# Altium project HATB-A0.PrjPCB
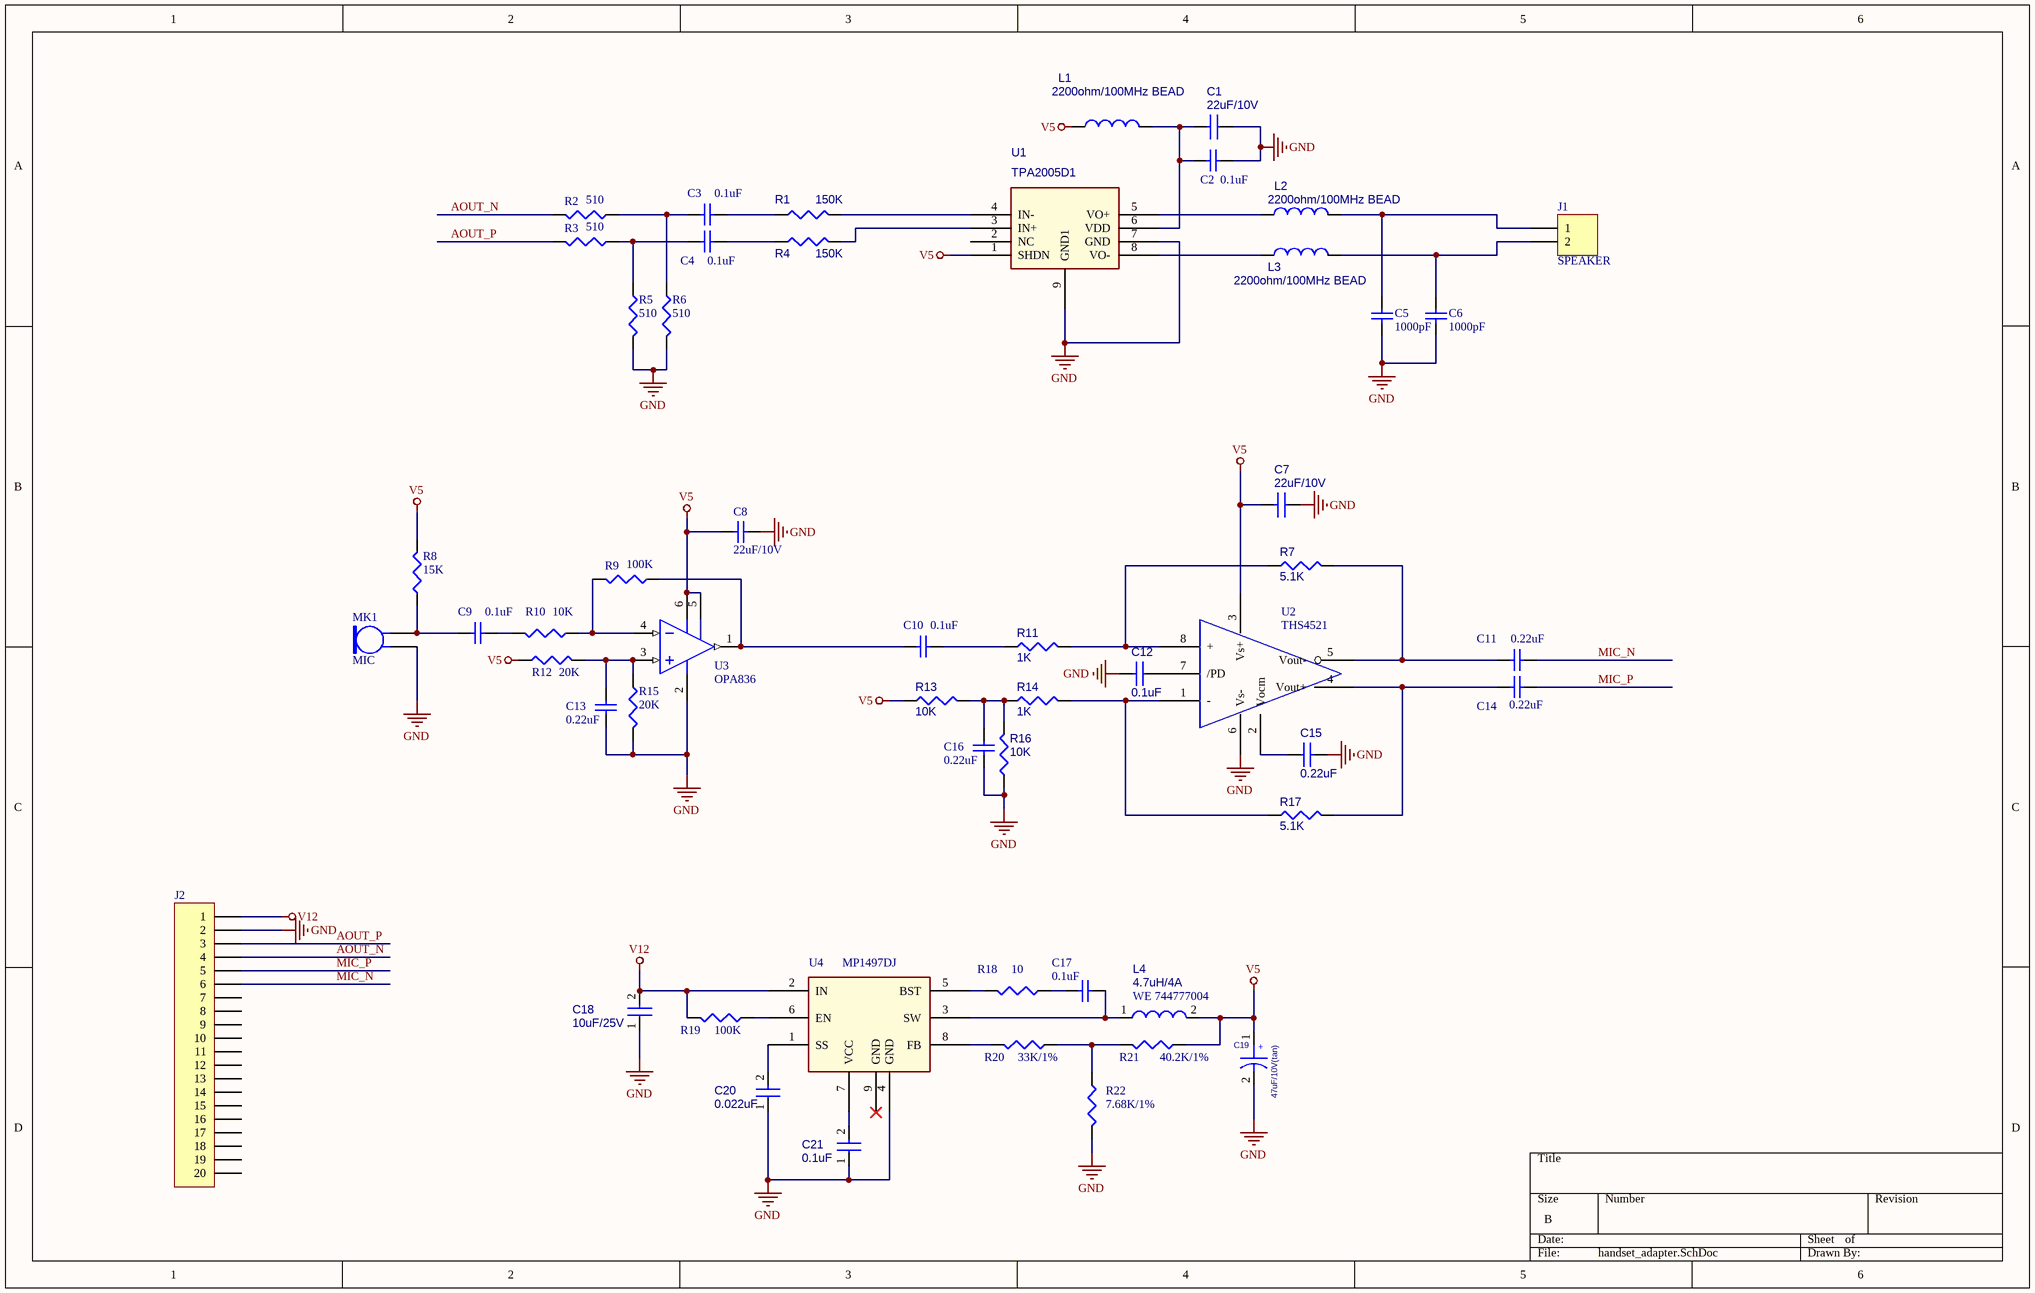
[diagram p0: handset_adapter.SchDoc]
1 sheet, 54 parts. Net scope: global (net labels, ports and power ports of the same name join across sheets).
Board file: HATB-A0.PcbDoc

## Sheet handset_adapter.SchDoc
size B

### Parts
C1  22uF/10V  [1210]
C2  0.1uF  [0603]
C3  0.1uF  [0603]
C4  0.1uF  [0603]
C5  1000pF  [0603]
C6  1000pF  [0603]
C7  22uF/10V  [1210]
C8  22uF/10V  [1210]
C9  0.1uF  [0603]
C10  0.1uF  [0603]
C11  0.22uF  [0603]
C12  0.1uF  [0603]
C13  0.22uF  [0603]
C14  0.22uF  [0603]
C15  0.22uF  [0603]
C16  0.22uF  [0603]
C17  0.1uF  [0603]
C18  10uF/25V  [1812]
C19  47uF/10V(tan)  [3528]
C20  0.022uF  [0603]
C21  0.1uF  [0603]
J1  SPEAKER  [HDR1X2]
J2  Header 20  [COMM-3MM-2X10]  (value not drawn)
L1  2200ohm/100MHz BEAD  [0603]
L2  2200ohm/100MHz BEAD  [0603]
L3  2200ohm/100MHz BEAD  [0603]
L4  4.7uH/4A  code: WE 744777004  [IND-4.7UH-4A]
MK1  MIC  [HDR1X2]
R1  150K  [0603]
R2  510  [0603]
R3  510  [0603]
R4  150K  [0603]
R5  510  [0603]
R6  510  [0603]
R7  5.1K  [0603]
R8  15K  [0603]
R9  100K  [0603]
R10  10K  [0603]
R11  1K  [0603]
R12  20K  [0603]
R13  10K  [0603]
R14  1K  [0603]
R15  20K  [0603]
R16  10K  [0603]
R17  5.1K  [0603]
R18  10  [0603]
R19  100K  [0603]
R20  33K/1%  [0603]
R21  40.2K/1%  [0603]
R22  7.68K/1%  [0603]
U1  TPA2005D1  [QFN-8]
U2  THS4521  [SO8]
U3  OPA836  [SOT23-6]
U4  MP1497DJ  [TSOT23-8]

### Nets
GND: C1.1 C2.2 C5.1 C6.1 C7.1 C8.1 C12.2 C13.1 C15.2 C16.1 C18.1 C19.2 C20.1 C21.1 J2.2 MK1.2 R5.2 R6.2 R15.2 R16.1 R22.2 U1.7(GND) U1.9(GND1) U2.6(Vs-) U3.2(V-) U4.4(GND)
V5: C7.2 C8.2 C19.1 L1.1 L4.2 R8.2 R12.1 R13.1 R21.1 U1.1(SHDN) U2.3(Vs+) U3.5(~{P}D) U3.6(V+)
V12: C18.2 J2.1 R19.2 U4.2(IN)
AOUT_N: J2.4 R2.2
AOUT_P: J2.3 R3.2
MIC_N: C11.1 J2.6
MIC_P: C14.1 J2.5
NetC1_2: C1.2 C2.1 L1.2 U1.6(VDD)
NetC3_1: C3.1 R2.1 R6.1
NetC3_2: C3.2 R1.1
NetC4_1: C4.1 R3.1 R5.1
NetC4_2: C4.2 R4.1
NetC5_2: C5.2 J1.1 L2.2
NetC6_2: C6.2 J1.2 L3.2
NetC9_1: C9.1 MK1.1 R8.1
NetC9_2: C9.2 R10.2
NetC10_1: C10.1 R9.1 U3.1(OUT)
NetC10_2: C10.2 R11.1
NetC11_2: C11.2 R7.2 U2.5(Vout-)
NetC12_1: C12.1 U2.7(/PD)
NetC13_2: C13.2 R12.2 R15.1 U3.3(IN+)
NetC14_2: C14.2 R17.2 U2.4(Vout+)
NetC15_1: C15.1 U2.2(Vocm)
NetC16_2: C16.2 R13.2 R14.1 R16.2
NetC17_1: C17.1 L4.1 U4.3(SW)
NetC17_2: C17.2 R18.1
NetC20_2: C20.2 U4.1(SS)
NetC21_2: C21.2 U4.7(VCC)
NetL2_1: L2.1 U1.5(VO+)
NetL3_1: L3.1 U1.8(VO-)
NetR1_2: R1.2 U1.4(IN-)
NetR4_2: R4.2 U1.3(IN+)
NetR7_1: R7.1 R11.2 U2.8(+)
NetR9_2: R9.2 R10.1 U3.4(IN-)
NetR14_2: R14.2 R17.1 U2.1(-)
NetR18_2: R18.2 U4.5(BST)
NetR19_1: R19.1 U4.6(EN)
NetR20_1: R20.1 R21.2 R22.1
NetR20_2: R20.2 U4.8(FB)

Not connected (* = marked no-connect by the designer): J2 7 8 9 10 11 12 13 14 15 16 17 18 19 20; U1 2(NC); U4 9(GND)*

### Notes on the sheet
- (in symbol CAP WP) +

### Library data of the parts
C1 C7 C12 C15 = P_CAP NP
C2-C6 C8-C11 C13 C14 C16 C17 = Cap: Capacitor
C18 C20 C21 = CAP NP_Dup2
C19 = CAP WP
J1 = Header 2: Header, 2-Pin; LatestRevisionDate: 17-Jul-2002; LatestRevisionNote: Re-released for DXP Platform.; Publisher: Altium Limited
J2 = Header 20: Header, 20-Pin; LatestRevisionDate: 17-Jul-2002; LatestRevisionNote: Re-released for DXP Platform.; Publisher: Altium Limited
L1-L3 = INDUCTOR_0: IND,FBEAD,SO 1206,30@100MHz,3 AMPS
L4 = 4.7UH_CDH2D09BNP-4R7MC_0.7A_20%
MK1 = Mic2: Microphone
R1 R4 R7 R11 R13 R14 R16 R17 = P_R
R2 R3 R5 R6 R8-R10 R12 R15 = Res3: Resistor
R18-R22 = CR16-1003FM
U1 = TPA2005D1_3
U4 = MP1482_5